# EAGLE design kaaEmonitor_1v0 (EAGLE 6.5.0)
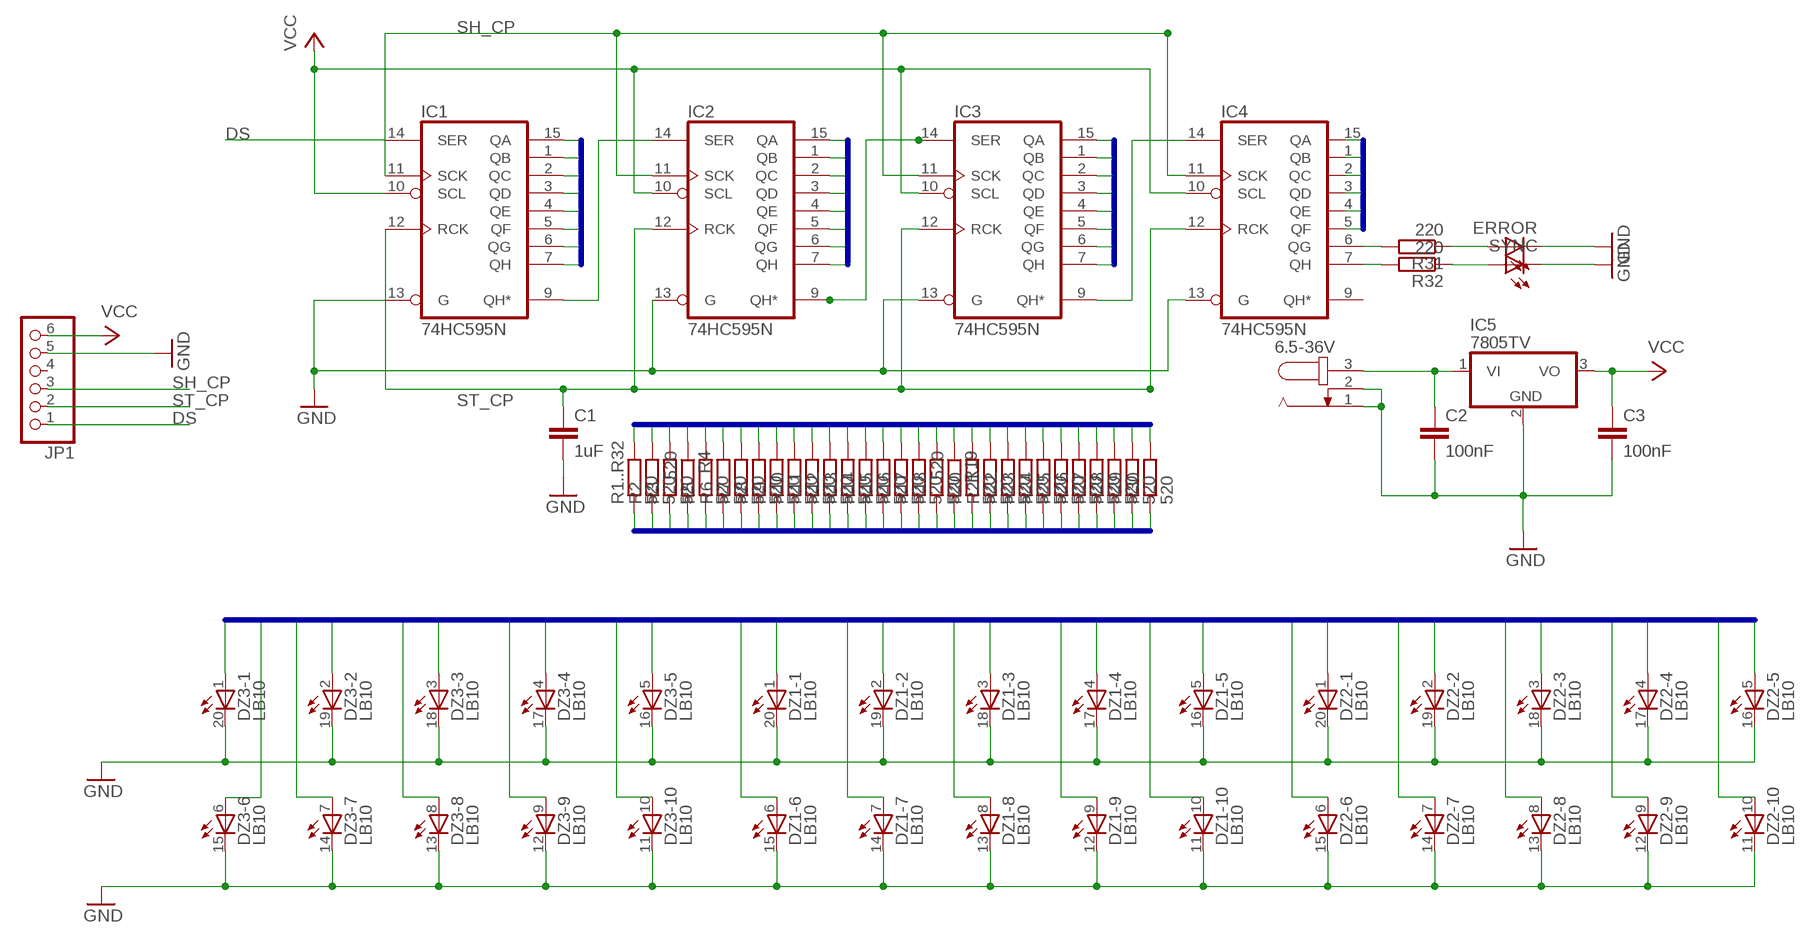
[diagram p0: schematic, sheet 1]

## Parts
6.5-36V  JACK-PLUG1  [SPC4078]
C1  1uF  C-EU025-025X050  [C025-025X050]
C2  100nF  C-EU025-024X044  [C025-024X044]
C3  100nF  C-EU025-024X044  [C025-024X044]
DZ1  LB10  [LB10]
DZ2  LB10  [LB10]
DZ3  LB10  [LB10]
ERROR  LED3MM  [LED3MM]
IC1  74HC595N  [DIL16]
IC2  74HC595N  [DIL16]
IC3  74HC595N  [DIL16]
IC4  74HC595N  [DIL16]
IC5  7805TV  [TO220V]
JP1  PINHD-1X6  [1X06]
R1..R32  520  R-EU_0204/7  [0204/7]
R2  520  R-EU_0204/7  [0204/7]
R3  520  R-EU_0204/7  [0204/7]
R4  520  R-EU_0204/7  [0204/7]
R5  520  R-EU_0204/7  [0204/7]
R6  520  R-EU_0204/7  [0204/7]
R7  520  R-EU_0204/7  [0204/7]
R8  520  R-EU_0204/7  [0204/7]
R9  520  R-EU_0204/7  [0204/7]
R10  520  R-EU_0204/7  [0204/7]
R11  520  R-EU_0204/7  [0204/7]
R12  520  R-EU_0204/7  [0204/7]
R13  520  R-EU_0204/7  [0204/7]
R14  520  R-EU_0204/7  [0204/7]
R15  520  R-EU_0204/7  [0204/7]
R16  520  R-EU_0204/7  [0204/7]
R17  520  R-EU_0204/7  [0204/7]
R18  520  R-EU_0204/7  [0204/7]
R19  520  R-EU_0204/7  [0204/7]
R20  520  R-EU_0204/7  [0204/7]
R21  520  R-EU_0204/7  [0204/7]
R22  520  R-EU_0204/7  [0204/7]
R23  520  R-EU_0204/7  [0204/7]
R24  520  R-EU_0204/7  [0204/7]
R25  520  R-EU_0204/7  [0204/7]
R26  520  R-EU_0204/7  [0204/7]
R27  520  R-EU_0204/7  [0204/7]
R28  520  R-EU_0204/7  [0204/7]
R29  520  R-EU_0204/7  [0204/7]
R30  520  R-EU_0204/7  [0204/7]
R31  220  R-EU_0204/7  [0204/7]
R32  220  R-EU_0204/7  [0204/7]
SYNC  LED3MM  [LED3MM]

## Nets
DS: IC1.14(SER) JP1.1
GND: 6.5-36V.1 6.5-36V.2 C1.2 C2.2 C3.2 DZ1.11(-10:C) DZ1.12(-9:C) DZ1.13(-8:C) DZ1.14(-7:C) DZ1.15(-6:C) DZ1.16(-5:C) DZ1.17(-4:C) DZ1.18(-3:C) DZ1.19(-2:C) DZ1.20(-1:C) DZ2.11(-10:C) DZ2.12(-9:C) DZ2.13(-8:C) DZ2.14(-7:C) DZ2.15(-6:C) DZ2.16(-5:C) DZ2.17(-4:C) DZ2.18(-3:C) DZ2.19(-2:C) DZ2.20(-1:C) DZ3.11(-10:C) DZ3.12(-9:C) DZ3.13(-8:C) DZ3.14(-7:C) DZ3.15(-6:C) DZ3.16(-5:C) DZ3.17(-4:C) DZ3.18(-3:C) DZ3.19(-2:C) DZ3.20(-1:C) ERROR.K(C) IC1.13(G) IC2.13(G) IC3.13(G) IC4.13(G) IC5.2(GND) JP1.5 SYNC.K(C)
LEDBUS1: DZ1.10(-10:A) R1..R32.1
LEDBUS2: DZ1.9(-9:A) R2.1
LEDBUS3: DZ1.8(-8:A) R3.1
LEDBUS4: DZ1.7(-7:A) R4.2
LEDBUS5: DZ1.6(-6:A) R5.1
LEDBUS6: DZ1.5(-5:A) R6.1
LEDBUS7: DZ1.4(-4:A) R7.1
LEDBUS8: DZ1.3(-3:A) R8.1
LEDBUS9: DZ1.2(-2:A) R9.1
LEDBUS10: DZ1.1(-1:A) R10.1
LEDBUS11: DZ2.10(-10:A) R11.1
LEDBUS12: DZ2.9(-9:A) R12.1
LEDBUS13: DZ2.8(-8:A) R13.1
LEDBUS14: DZ2.7(-7:A) R14.1
LEDBUS15: DZ2.6(-6:A) R15.1
LEDBUS16: DZ2.5(-5:A) R16.1
LEDBUS17: DZ2.4(-4:A) R17.1
LEDBUS18: DZ2.3(-3:A) R18.1
LEDBUS19: DZ2.2(-2:A) R19.2
LEDBUS20: DZ2.1(-1:A) R20.1
LEDBUS21: DZ3.10(-10:A) R21.1
LEDBUS22: DZ3.9(-9:A) R22.1
LEDBUS23: DZ3.8(-8:A) R23.1
LEDBUS24: DZ3.7(-7:A) R24.1
LEDBUS25: DZ3.6(-6:A) R25.1
LEDBUS26: DZ3.5(-5:A) R26.1
LEDBUS27: DZ3.4(-4:A) R27.1
LEDBUS28: DZ3.3(-3:A) R28.1
LEDBUS29: DZ3.2(-2:A) R29.1
LEDBUS30: DZ3.1(-1:A) R30.1
N$1: IC1.9(QH*) IC2.14(SER)
N$2: IC2.9(QH*) IC3.14(SER)
N$3: IC3.9(QH*) IC4.14(SER)
N$4: ERROR.A R31.1
N$5: R32.1 SYNC.A
N$6: IC4.6(QG) R31.2
N$7: IC4.7(QH) R32.2
N$8: 6.5-36V.3 C2.1 IC5.1(VI)
QBUS1: IC1.15(QA) R1..R32.2
QBUS2: IC1.1(QB) R2.2
QBUS3: IC1.2(QC) R3.2
QBUS4: IC1.3(QD) R4.1
QBUS5: IC1.4(QE) R5.2
QBUS6: IC1.5(QF) R6.2
QBUS7: IC1.6(QG) R7.2
QBUS8: IC1.7(QH) R8.2
QBUS9: IC2.15(QA) R9.2
QBUS10: IC2.1(QB) R10.2
QBUS11: IC2.2(QC) R11.2
QBUS12: IC2.3(QD) R12.2
QBUS13: IC2.4(QE) R13.2
QBUS14: IC2.5(QF) R14.2
QBUS15: IC2.6(QG) R15.2
QBUS16: IC2.7(QH) R16.2
QBUS17: IC3.15(QA) R17.2
QBUS18: IC3.1(QB) R18.2
QBUS19: IC3.2(QC) R19.1
QBUS20: IC3.3(QD) R20.2
QBUS21: IC3.4(QE) R21.2
QBUS22: IC3.5(QF) R22.2
QBUS23: IC3.6(QG) R23.2
QBUS24: IC3.7(QH) R24.2
QBUS25: IC4.15(QA) R25.2
QBUS26: IC4.1(QB) R26.2
QBUS27: IC4.2(QC) R27.2
QBUS28: IC4.3(QD) R28.2
QBUS29: IC4.4(QE) R29.2
QBUS30: IC4.5(QF) R30.2
SH_CP: IC1.11(SCK) IC2.11(SCK) IC3.11(SCK) IC4.11(SCK) JP1.3
ST_CP: C1.1 IC1.12(RCK) IC2.12(RCK) IC3.12(RCK) IC4.12(RCK) JP1.2
VCC: C3.1 IC1.10(SCL) IC2.10(SCL) IC3.10(SCL) IC4.10(SCL) IC5.3(VO) JP1.6
Unconnected: IC4.9(QH*) JP1.4

## Buses
QBUS[1..30]
LEDBUS[1..30]

## Power pins joined to a net without a drawn wire
GND: IC1.8(GND) IC2.8(GND) IC3.8(GND) IC4.8(GND)
VCC: IC1.16(VCC) IC2.16(VCC) IC3.16(VCC) IC4.16(VCC)

## Library data of the parts
6.5-36V = con-jack:JACK-PLUG: DC POWER JACK Power Jack, DC, Right Angle, Through Hole, Rated 5A at 16VDC, PC Terminals Distributor: Farnell (www.Farnell.de) Drawing: 84N1161.pdf / 84N1162.pdf Manufacturer: SPC Technology (www.spctechnology.com) Type: SPC4077 / SPC 4078; OC_FARNELL: unknown; OC_NEWARK: unknown
C1-C3 = resistor:C-EU: CAPACITOR, European symbol
DZ1-DZ3 = led:LB10: LED BLOCK 10-LED bar graph, DIL, Siemens
ERROR SYNC = led:LED: LED OSRAM: - CHIPLED LG R971, LG N971, LY N971, LG Q971, LY Q971, LO R971, LY R971 LH N974, LH R974 LS Q976, LO Q976, LY Q976 LO Q996 - Hyper CHIPLED LW Q18S LB Q993, LB Q99A, LB R99A - SideLED LS A670, LO A670, LY A670, LG A670, LP A670 LB A673, LV A673, LT A673, LW A673 LH A674 LY A675 LS A676, LA A676, LO A676, LY A676, LW A676 LS A679, LY A679, LG A679 - Hyper Micro SIDELED® LS Y876, LA Y876, LO Y876, LY Y876 LT Y87S - SmartLED LW L88C, LW L88S LB L89C, LB L89S, LG L890 LS L89K, LO L89K, LY L89K LS L896, LA L896, LO L896, LY L896 - TOPLED LS T670, LO T670, LY T670, LG T670, LP T670 LSG T670, LSP T670, LSY T670, LOP T670, LYG T670 LG T671, LOG T671, LSG T671 LB T673, LV T673, LT T673, LW T673 LH T674 LS T676, LA T676, LO T676, LY T676, LB T676, LH T676, LSB T676, LW T676 LB T67C, LV T67C, LT T67C, LS T67K, LO T67K, LY T67K, LW E67C LS E67B, LA E67B, LO E67B, LY E67B, LB E67C, LV E67C, LT E67C LW T67C LS T679, LY T679, LG T679 LS T770, LO T770, LY T770, LG T770, LP T770 LB T773, LV T773, LT T773, LW T773 LH T774 LS E675, LA E675, LY E675, LS T675 LS T776, LA T776, LO T776, LY T776, LB T776 LHGB T686 LT T68C, LB T68C - Hyper Mini TOPLED® LB M676 - Mini TOPLED Santana® LG M470 LS M47K, LO M47K, LY M47K Source: http://www.osram.convergy.de LUXEON: - LUMILED® LXK2-PW12-R00, LXK2-PW12-S00, LXK2-PW14-U00, LXK2-PW14-V00 LXK2-PM12-R00, LXK2-PM12-S00, LXK2-PM14-U00 LXK2-PE12-Q00, LXK2-PE12-R00, LXK2-PE12-S00, LXK2-PE14-T00, LXK2-PE14-U00 LXK2-PB12-K00, LXK2-PB12-L00, LXK2-PB12-M00, LXK2-PB14-N00, LXK2-PB14-P00, LXK2-PB14-Q00 LXK2-PR12-L00, LXK2-PR12-M00, LXK2-PR14-Q00, LXK2-PR14-R00 LXK2-PD12-Q00, LXK2-PD12-R00, LXK2-PD12-S00 LXK2-PH12-R00, LXK2-PH12-S00 LXK2-PL12-P00, LXK2-PL12-Q00, LXK2-PL12-R00 Source: www.luxeon.com KINGBRIGHT: KA-3528ASYC Source: www.kingbright.com
IC1-IC4 = 74xx-eu:74*595: 8-bit SHIFT REGISTER, output latch
IC5 = linear:78*: Positive VOLTAGE REGULATOR Source: http://cache.national.com/ds/LM/LM78L05.pdf http://www.fairchildsemi.com/ds/LM/LM7805.pdf
JP1 = pinhead:PINHD-1X6: PIN HEADER
R1..R32 R2-R32 = resistor:R-EU_: RESISTOR, European symbol

## Board
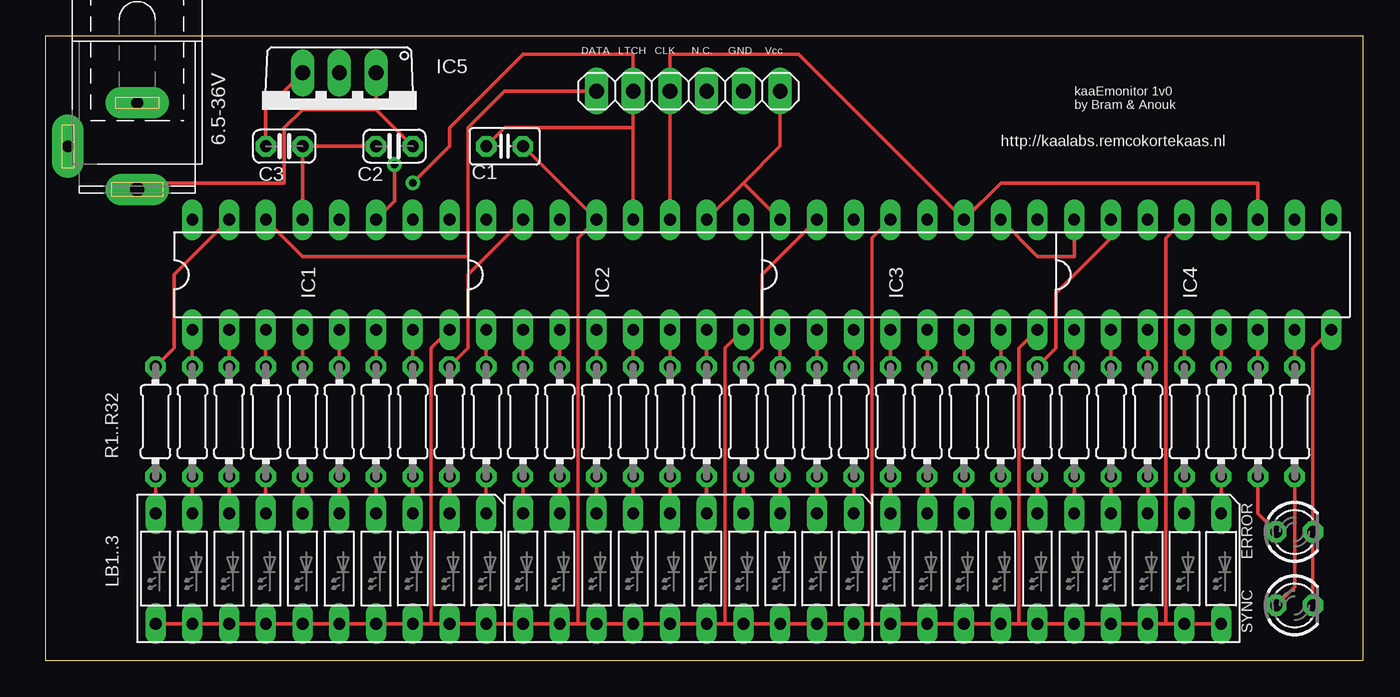
[diagram p1: board, top side]
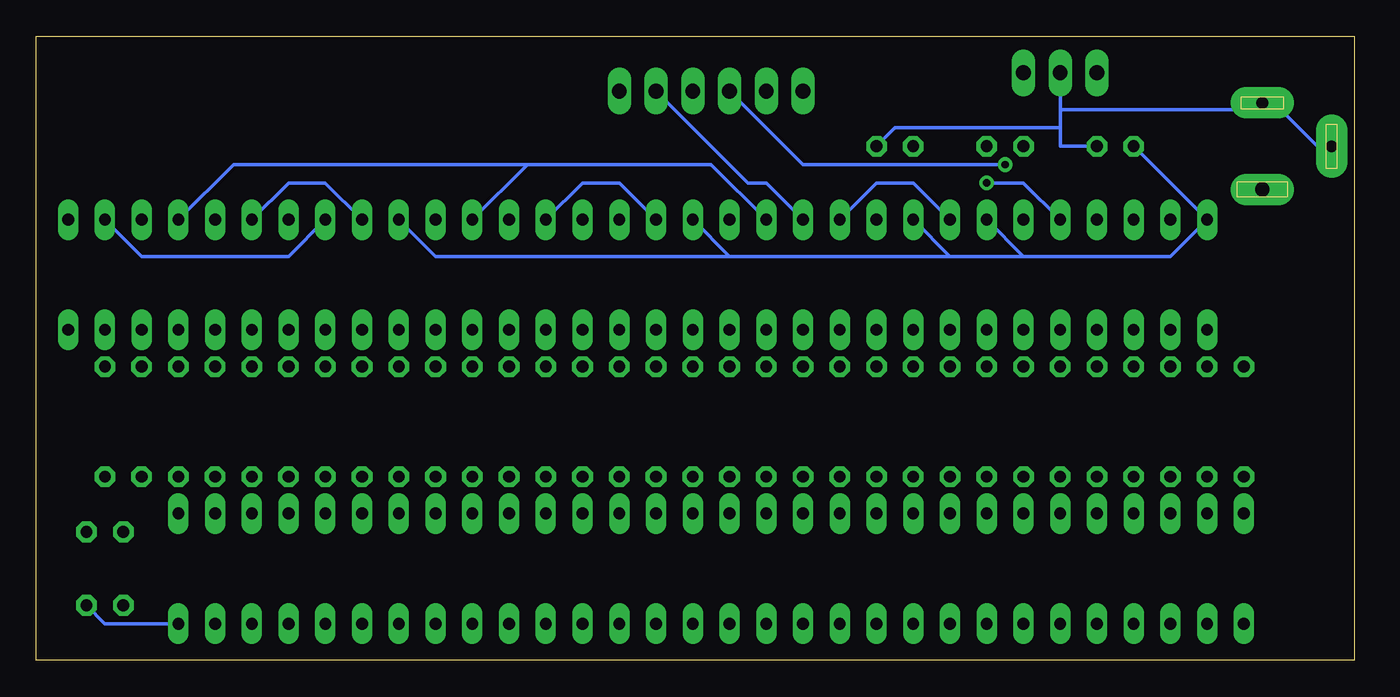
[diagram p2: board, bottom side, seen from below]

Size 91.11 x 43.17 mm. Coordinates in mm from the lower left corner, seen from the top.
Outline: 0,0 91.11,0 91.11,43.17 0,43.17 0,0
Copper layers (1*16): Top 0.035mm / dielectric 1.5mm / Bottom 0.035mm
Design rules "SparkFun *": minimum track width 10mil, minimum drill 20mil, track to track 8mil, track to pad 8mil, pad to pad 8mil, via to via 8mil, smd to smd 8mil, copper to edge 10mil, drill to drill 8mil, minimum pad ring 12mil, minimum via ring 10mil, stop-mask expansion 4mil, vias tented up to drill 25mil, thermal gap 10mil

### Footprints (pad centres in the part's own frame; a part is rotated, then mirrored left to right if it is on the bottom)
SPC4078 = drill 0.8 pad 2.184 long: 1 -3,0; 2 0,-4.8 | drill 1 pad 2.184 long: 3 3,0
C025-025X050 = drill 0.813 octagon: 1 -1.27,0; 2 1.27,0
C025-024X044 = drill 0.813 octagon: 1 -1.27,0; 2 1.27,0
LB10 = drill 0.813 long: 1 -11.43,-3.81; 2 -8.89,-3.81; 3 -6.35,-3.81; 4 -3.81,-3.81; 5 -1.27,-3.81; 6 1.27,-3.81; 7 3.81,-3.81; 8 6.35,-3.81; 9 8.89,-3.81; 10 11.43,-3.81; 11 11.43,3.81; 12 8.89,3.81; 13 6.35,3.81; 14 3.81,3.81; 15 1.27,3.81; 16 -1.27,3.81; 17 -3.81,3.81; 18 -6.35,3.81; 19 -8.89,3.81; 20 -11.43,3.81
LED3MM = drill 0.813 octagon: A -1.27,0; K 1.27,0
DIL16 = drill 0.813 long: 1 -8.89,-3.81; 2 -6.35,-3.81; 3 -3.81,-3.81; 4 -1.27,-3.81; 5 1.27,-3.81; 6 3.81,-3.81; 7 6.35,-3.81; 8 8.89,-3.81; 9 8.89,3.81; 10 6.35,3.81; 11 3.81,3.81; 12 1.27,3.81; 13 -1.27,3.81; 14 -3.81,3.81; 15 -6.35,3.81; 16 -8.89,3.81
TO220V = drill 1.016 long: 1 -2.54,-2.54; 2 0,-2.54; 3 2.54,-2.54
1X06 = drill 1.016 long: 1 -6.35,0; 2 -3.81,0; 3 -1.27,0; 4 1.27,0; 5 3.81,0; 6 6.35,0
0204/7 = drill 0.813 octagon: 1 -3.81,0; 2 3.81,0

### Placement (x,y rotation side)
6.5-36V  6.35,35.56 270 top
C1  31.75,35.56 0 top
C2  24.13,35.56 180 top
C3  16.51,35.56 0 top
DZ1  19.05,6.35 180 top
DZ2  44.45,6.35 180 top
DZ3  69.85,6.35 180 top
ERROR  86.36,8.89 0 top
IC1  19.05,26.67 0 top
IC2  39.37,26.67 0 top
IC3  59.69,26.67 0 top
IC4  80.01,26.67 0 top
IC5  20.32,38.1 180 top
JP1  44.45,39.37 0 top
R1..R32  7.62,16.51 90 top
R2  10.16,16.51 90 top
R3  12.7,16.51 90 top
R4  15.24,16.51 270 top
R5  17.78,16.51 90 top
R6  20.32,16.51 90 top
R7  22.86,16.51 90 top
R8  25.4,16.51 90 top
R9  27.94,16.51 90 top
R10  30.48,16.51 90 top
R11  33.02,16.51 90 top
R12  35.56,16.51 90 top
R13  38.1,16.51 90 top
R14  40.64,16.51 90 top
R15  43.18,16.51 90 top
R16  45.72,16.51 90 top
R17  48.26,16.51 90 top
R18  50.8,16.51 90 top
R19  53.34,16.51 270 top
R20  55.88,16.51 90 top
R21  58.42,16.51 90 top
R22  60.96,16.51 90 top
R23  63.5,16.51 90 top
R24  66.04,16.51 90 top
R25  68.58,16.51 90 top
R26  71.12,16.51 90 top
R27  73.66,16.51 90 top
R28  76.2,16.51 90 top
R29  78.74,16.51 90 top
R30  81.28,16.51 90 top
R31  83.82,16.51 90 top
R32  86.36,16.51 90 top
SYNC  86.36,3.81 0 top

### Tracks (layer width: path | path; a pad name or v marks a point on that pad's centre or on a via)
DS
  Top 0.254: IC1.14 17.78,27.94 29.21,27.94 29.21,36.83 31.75,39.37 JP1.1
GND
  Top 0.254: C1.2 IC2.13 36.83,29.21 36.83,2.54 | IC1.13 C3.2 C2.2 | SYNC.K ERROR.K 87.63,21.59 IC4.8 | DZ1.11 DZ1.12 DZ1.13 DZ1.14 DZ1.15 DZ1.16 DZ1.17 DZ1.18 26.67,2.54 | 26.67,2.54 DZ1.19 DZ1.20 DZ2.11 DZ2.12 36.83,2.54 | 36.83,2.54 DZ2.13 DZ2.14 DZ2.15 DZ2.16 46.99,2.54 | 46.99,2.54 DZ2.17 DZ2.18 DZ2.19 DZ2.20 57.15,2.54 | 57.15,2.54 DZ3.11 DZ3.12 DZ3.13 DZ3.14 67.31,2.54 | 67.31,2.54 DZ3.15 DZ3.16 DZ3.17 DZ3.18 77.47,2.54 | 77.47,2.54 DZ3.19 DZ3.20 | IC1.8 26.67,21.59 26.67,2.54 | IC2.8 46.99,21.59 46.99,2.54 | IC3.13 57.15,29.21 57.15,2.54 | IC3.8 67.31,21.59 67.31,2.54 | IC4.13 77.47,29.21 77.47,2.54
  Bottom 0.254: JP1.5 41.91,33.02 40.64,33.02 IC2.13 | 6.35,38.1 5.08,38.1 2.54,35.56 6.5-36V.2 | 20.32,36.83 20.32,35.56 C3.2 | 20.32,36.83 20.32,38.1 | 20.32,38.1 IC5.2 | 20.32,38.1 6.35,38.1 | 6.35,38.1 6.5-36V.1 | C1.2 31.75,36.83 20.32,36.83 | SYNC.K 86.36,2.54 DZ3.20
LEDBUS1
  Top 0.254: R1..R32.1 DZ1.10
LEDBUS2
  Top 0.254: R2.1 DZ1.9
LEDBUS3
  Top 0.254: R3.1 DZ1.8
LEDBUS4
  Top 0.254: R4.2 DZ1.7
LEDBUS5
  Top 0.254: R5.1 DZ1.6
LEDBUS6
  Top 0.254: R6.1 DZ1.5
LEDBUS7
  Top 0.254: R7.1 DZ1.4
LEDBUS8
  Top 0.254: R8.1 DZ1.3
LEDBUS9
  Top 0.254: R9.1 DZ1.2
LEDBUS10
  Top 0.254: R10.1 DZ1.1
LEDBUS11
  Top 0.254: R11.1 DZ2.10
LEDBUS12
  Top 0.254: R12.1 DZ2.9
LEDBUS13
  Top 0.254: R13.1 DZ2.8
LEDBUS14
  Top 0.254: R14.1 DZ2.7
LEDBUS15
  Top 0.254: R15.1 DZ2.6
LEDBUS16
  Top 0.254: R16.1 DZ2.5
LEDBUS17
  Top 0.254: R17.1 DZ2.4
LEDBUS18
  Top 0.254: R18.1 DZ2.3
LEDBUS19
  Top 0.254: R19.2 DZ2.2
LEDBUS20
  Top 0.254: R20.1 DZ2.1
LEDBUS21
  Top 0.254: R21.1 DZ3.10
LEDBUS22
  Top 0.254: R22.1 DZ3.9
LEDBUS23
  Top 0.254: R23.1 DZ3.8
LEDBUS24
  Top 0.254: R24.1 DZ3.7
LEDBUS25
  Top 0.254: R25.1 DZ3.6
LEDBUS26
  Top 0.254: R26.1 DZ3.5
LEDBUS27
  Top 0.254: R27.1 DZ3.4
LEDBUS28
  Top 0.254: R28.1 DZ3.3
LEDBUS29
  Top 0.254: R29.1 DZ3.2
LEDBUS30
  Top 0.254: R30.1 DZ3.1
N$1
  Bottom 0.254: IC1.9 30.48,33.02 33.02,33.02 IC2.14
N$2
  Bottom 0.254: IC2.9 50.8,33.02 53.34,33.02 IC3.14
N$3
  Bottom 0.254: IC3.9 71.12,33.02 73.66,33.02 IC4.14
N$4
  Top 0.254: ERROR.A 83.82,10.16 R31.1
N$5
  Top 0.254: SYNC.A 86.36,5.08 R32.1
N$6
  Top 0.254: IC4.6 R31.2
N$7
  Top 0.254: IC4.7 R32.2
N$8
  Top 0.254: 22.86,38.1 C2.1 | IC5.1 22.86,38.1 | 22.86,38.1 17.78,38.1 16.51,36.83 16.51,33.02 6.35,33.02 6.5-36V.3
QBUS1
  Top 0.254: R1..R32.2 8.89,21.59 8.89,26.67 IC1.15
QBUS2
  Top 0.254: IC1.1 R2.2
QBUS3
  Top 0.254: IC1.2 R3.2
QBUS4
  Top 0.254: IC1.3 R4.1
QBUS5
  Top 0.254: IC1.4 R5.2
QBUS6
  Top 0.254: IC1.5 R6.2
QBUS7
  Top 0.254: IC1.6 R7.2
QBUS8
  Top 0.254: IC1.7 R8.2
QBUS9
  Top 0.254: R9.2 29.21,21.59 29.21,26.67 IC2.15
QBUS10
  Top 0.254: IC2.1 R10.2
QBUS11
  Top 0.254: IC2.2 R11.2
QBUS12
  Top 0.254: IC2.3 R12.2
QBUS13
  Top 0.254: IC2.4 R13.2
QBUS14
  Top 0.254: IC2.5 R14.2
QBUS15
  Top 0.254: IC2.6 R15.2
QBUS16
  Top 0.254: IC2.7 R16.2
QBUS17
  Top 0.254: R17.2 49.53,21.59 49.53,26.67 IC3.15
QBUS18
  Top 0.254: IC3.1 R18.2
QBUS19
  Top 0.254: IC3.2 R19.1
QBUS20
  Top 0.254: IC3.3 R20.2
QBUS21
  Top 0.254: IC3.4 R21.2
QBUS22
  Top 0.254: IC3.5 R22.2
QBUS23
  Top 0.254: IC3.6 R23.2
QBUS24
  Top 0.254: IC3.7 R24.2
QBUS25
  Top 0.254: R25.2 69.85,21.59 69.85,25.4 73.66,29.21 IC4.15
QBUS26
  Top 0.254: IC4.1 R26.2
QBUS27
  Top 0.254: IC4.2 R27.2
QBUS28
  Top 0.254: IC4.3 R28.2
QBUS29
  Top 0.254: IC4.4 R29.2
QBUS30
  Top 0.254: IC4.5 R30.2
SH_CP  (via drill 0.51)
  Top 0.254: IC4.11 83.82,33.02 66.04,33.02 IC3.11 52.07,41.91 43.18,41.91 JP1.3 IC2.11 | IC1.11 24.13,31.75 v24.13,34.29
  Bottom 0.254: v24.13,34.29 38.1,34.29 JP1.3
ST_CP  (via drill 0.51)
  Top 0.254: v25.4,33.02 27.94,35.56 27.94,36.83 33.02,41.91 40.64,41.91 JP1.2 40.64,36.83 | 40.64,36.83 IC2.12 | C1.1 31.75,36.83 40.64,36.83
  Bottom 0.254: IC1.12 22.86,33.02 v25.4,33.02 | 57.15,34.29 IC3.12 | 57.15,34.29 44.45,34.29 IC2.12 | IC4.12 77.47,34.29 57.15,34.29
VCC
  Top 0.254: IC3.10 68.58,27.94 71.12,27.94 IC4.16 | 48.26,33.02 50.8,35.56 JP1.6 | 48.26,33.02 IC2.10 | 48.26,33.02 IC3.16 | IC5.3 15.24,38.1 C3.1
  Bottom 0.254: IC4.10 83.82,27.94 73.66,27.94 IC4.16 | C3.1 IC1.16 12.7,27.94 22.86,27.94 | 22.86,27.94 IC1.10 | 27.94,27.94 IC2.16 | 22.86,27.94 27.94,27.94 | 43.18,27.94 IC2.10 | 27.94,27.94 43.18,27.94 | IC3.10 63.5,27.94 43.18,27.94

### Text on the board
tNames: DATA | LTCH | CLK | N.C. | GND | Vcc | kaaEmonitor 1v0 / by Bram & Anouk | http://kaalabs.remcokortekaas.nl | LB1..3